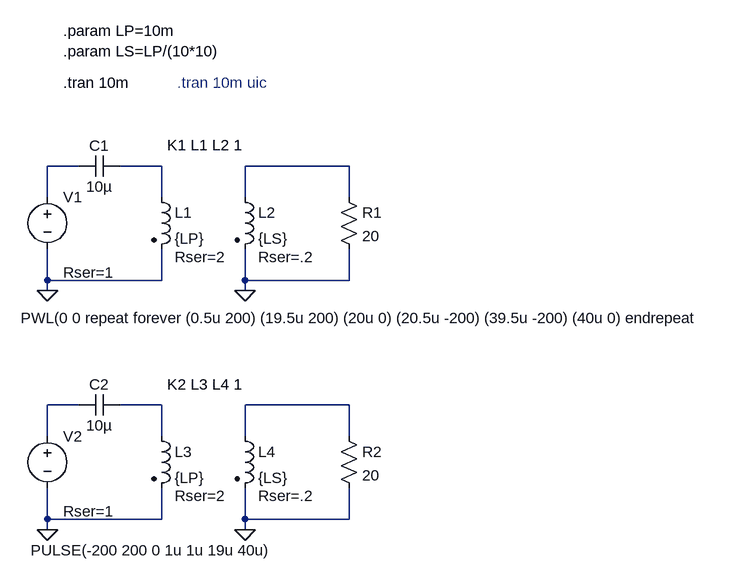
[diagram p0: schematic pulse_trafo1.asc]
pulse_trafo1.asc, the LTspice schematic file:
Version 4
SHEET 1 1360 680
WIRE 176 48 128 48
WIRE 304 48 240 48
WIRE 592 48 432 48
WIRE 128 96 128 48
WIRE 304 96 304 48
WIRE 432 96 432 48
WIRE 592 96 592 48
WIRE 128 224 128 176
WIRE 304 224 304 176
WIRE 304 224 128 224
WIRE 432 224 432 176
WIRE 592 224 592 176
WIRE 592 224 432 224
WIRE 128 240 128 224
WIRE 432 240 432 224
WIRE 176 416 128 416
WIRE 304 416 240 416
WIRE 592 416 432 416
WIRE 128 464 128 416
WIRE 304 464 304 416
WIRE 432 464 432 416
WIRE 592 464 592 416
WIRE 128 592 128 544
WIRE 304 592 304 544
WIRE 304 592 128 592
WIRE 432 592 432 544
WIRE 592 592 592 544
WIRE 592 592 432 592
WIRE 128 608 128 592
WIRE 432 608 432 592
FLAG 128 240 0
FLAG 432 240 0
FLAG 128 608 0
FLAG 432 608 0
SYMBOL voltage 128 80 R0
WINDOW 3 -41 202 Left 0
WINDOW 123 0 0 Left 0
WINDOW 39 24 132 Left 0
SYMATTR InstName V1
SYMATTR Value PWL(0 0 repeat forever (0.5u 200) (19.5u 200) (20u 0) (20.5u -200) (39.5u -200) (40u 0) endrepeat
SYMATTR SpiceLine Rser=1
SYMBOL ind2 288 80 R0
WINDOW 39 36 108 Left 0
SYMATTR InstName L1
SYMATTR Value {LP}
SYMATTR Type ind
SYMATTR SpiceLine Rser=2
SYMBOL ind2 416 80 R0
WINDOW 39 36 108 Left 0
SYMATTR InstName L2
SYMATTR Value {LS}
SYMATTR Type ind
SYMATTR SpiceLine Rser=.2
SYMBOL res 576 80 R0
SYMATTR InstName R1
SYMATTR Value 20
SYMBOL cap 176 64 R270
WINDOW 0 32 32 VTop 0
WINDOW 3 0 32 VBottom 0
SYMATTR InstName C1
SYMATTR Value 10µ
SYMBOL voltage 128 448 R0
WINDOW 3 -26 192 Left 0
WINDOW 123 0 0 Left 0
WINDOW 39 24 132 Left 0
SYMATTR InstName V2
SYMATTR Value PULSE(-200 200 0 1u 1u 19u 40u)
SYMATTR SpiceLine Rser=1
SYMBOL ind2 288 448 R0
WINDOW 39 36 108 Left 0
SYMATTR InstName L3
SYMATTR Value {LP}
SYMATTR Type ind
SYMATTR SpiceLine Rser=2
SYMBOL ind2 416 448 R0
WINDOW 39 36 108 Left 0
SYMATTR InstName L4
SYMATTR Value {LS}
SYMATTR Type ind
SYMATTR SpiceLine Rser=.2
SYMBOL res 576 448 R0
SYMATTR InstName R2
SYMATTR Value 20
SYMBOL cap 176 432 R270
WINDOW 0 32 32 VTop 0
WINDOW 3 0 32 VBottom 0
SYMATTR InstName C2
SYMATTR Value 10µ
TEXT 152 -160 Left 0 !.param LP=10m\n.param LS=LP/(10*10)
TEXT 152 -80 Left 0 !.tran 10m 
TEXT 312 16 Left 0 !K1 L1 L2 1
TEXT 312 384 Left 0 !K2 L3 L4 1
TEXT 328 -80 Left 0 ;.tran 10m uic

The netlist it stands for:
* pulse_trafo1.asc
V1 N001 0 PWL(0 0 repeat forever (0.5u 200) (19.5u 200) (20u 0) (20.5u -200) (39.5u -200) (40u 0) endrepeat Rser=1
L1 N002 0 {LP} Rser=2
L2 N003 0 {LS} Rser=.2
R1 N003 0 20
C1 N001 N002 10µ
V2 N004 0 PULSE(-200 200 0 1u 1u 19u 40u) Rser=1
L3 N005 0 {LP} Rser=2
L4 N006 0 {LS} Rser=.2
R2 N006 0 20
C2 N004 N005 10µ
.param LP=10m
.param LS=LP/(10*10)
.tran 10m
K1 L1 L2 1
K2 L3 L4 1
* .tran 10m uic
.backanno
.end